# Altium schematic sheet auto-discharge.SchDoc
size A; SheetNumber: 5
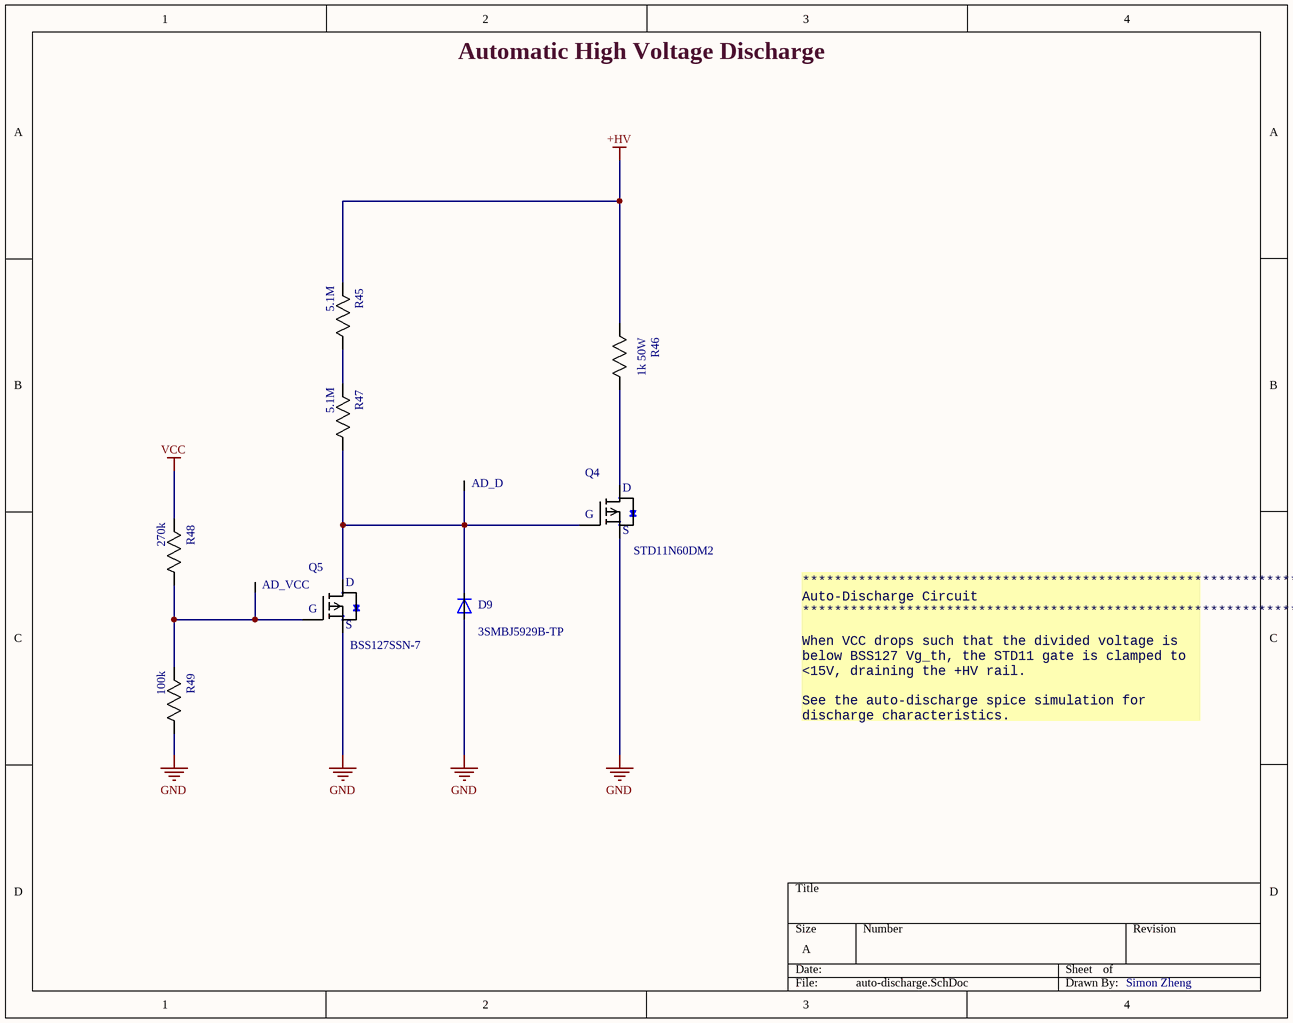
[diagram p0: auto-discharge.SchDoc]

## Parts
AD_D  Test Point (Via)  [TP]  (value not drawn)
AD_VCC  Test Point (Via)  [TP]  (value not drawn)
D9  3SMBJ5929B-TP  [DO-214AA]
Q4  STD11N60DM2  [DPAK (TO-252)]
Q5  BSS127SSN-7  [SOT95P245X89-3M]
R45  5.1M  [0805]
R46  1k 50W  [D2PAK (TO-263)]
R47  5.1M  [0805]
R48  270k  [0805]
R49  100k  [0805]

## Nets
+HV: R45.2(R2) R46.2(R2)
GND: D9.A Q4.S Q5.S R49.1(R1)
VCC: R48.2(R2)
NetAD_D_1: AD_D.1 D9.C Q4.G Q5.D R47.1(R1)
NetAD_VCC_1: AD_VCC.1 Q5.G R48.1(R1) R49.2(R2)
NetQ4_D: Q4.D R46.1(R1)
NetR45_1: R45.1(R1) R47.2(R2)

## Notes on the sheet
- Automatic High Voltage Discharge
- **********************************************************************
  Auto-Discharge Circuit
  **********************************************************************
  When VCC drops such that the divided voltage is below BSS127 Vg_th, the STD11 gate is clamped to <15V, draining the +HV rail.
  See the auto-discharge spice simulation for discharge characteristics.
- Simon Zheng

## Library data of the parts
D9 = DIODE ZENER 15V 3W: Supplier 1: Digi-Key; Supplier Part Number 1: 3SMBJ5929BTPMSCT-ND
Q4 = STD11N60DM2: pin to pad: D>2 G>1 S>3; MFG: STMicroelectronics; Supplier: Digikey; Supplier PN: 497-16925-1-ND
Q5 = BSS127SSN-7: Small Signal N-Ch, 600Vds; MFG: Diodes Incorporated; Supplier: Digikey; Supplier PN: BSS127SSN-7DICT-ND
R45 R47 = RES 5.1M 1/8W-5%: RES SMD 5.1 MOHM 5% 1/8W 0805; Power (Watts): 0.125W; Package: 0805; Value: 5.1M; Tolerance: 5%
R46 = RES 1.5k 50W: RES SMD 1.5K OHM 1% 50W D2PAK; Package: D2PAK (TO-263); Value: 1.5k; Power (Watts): 50W; Tolerance: 1%
R48 = RES 270k 1/8W: RES SMD 270K OHM 5% 1/8W 0805; Power (Watts): 0.125W; Package: 0805; Value: 270k; Tolerance: 5%
R49 = RES 100k 1/8W - 1%: RES SMD 100K OHM 1% 1/8W 0805; Power (Watts): 0.125W; Package: 0805; Value: 100k; Tolerance: 1%